# Altium project Capybara.PrjPcb (part 1 of 3)
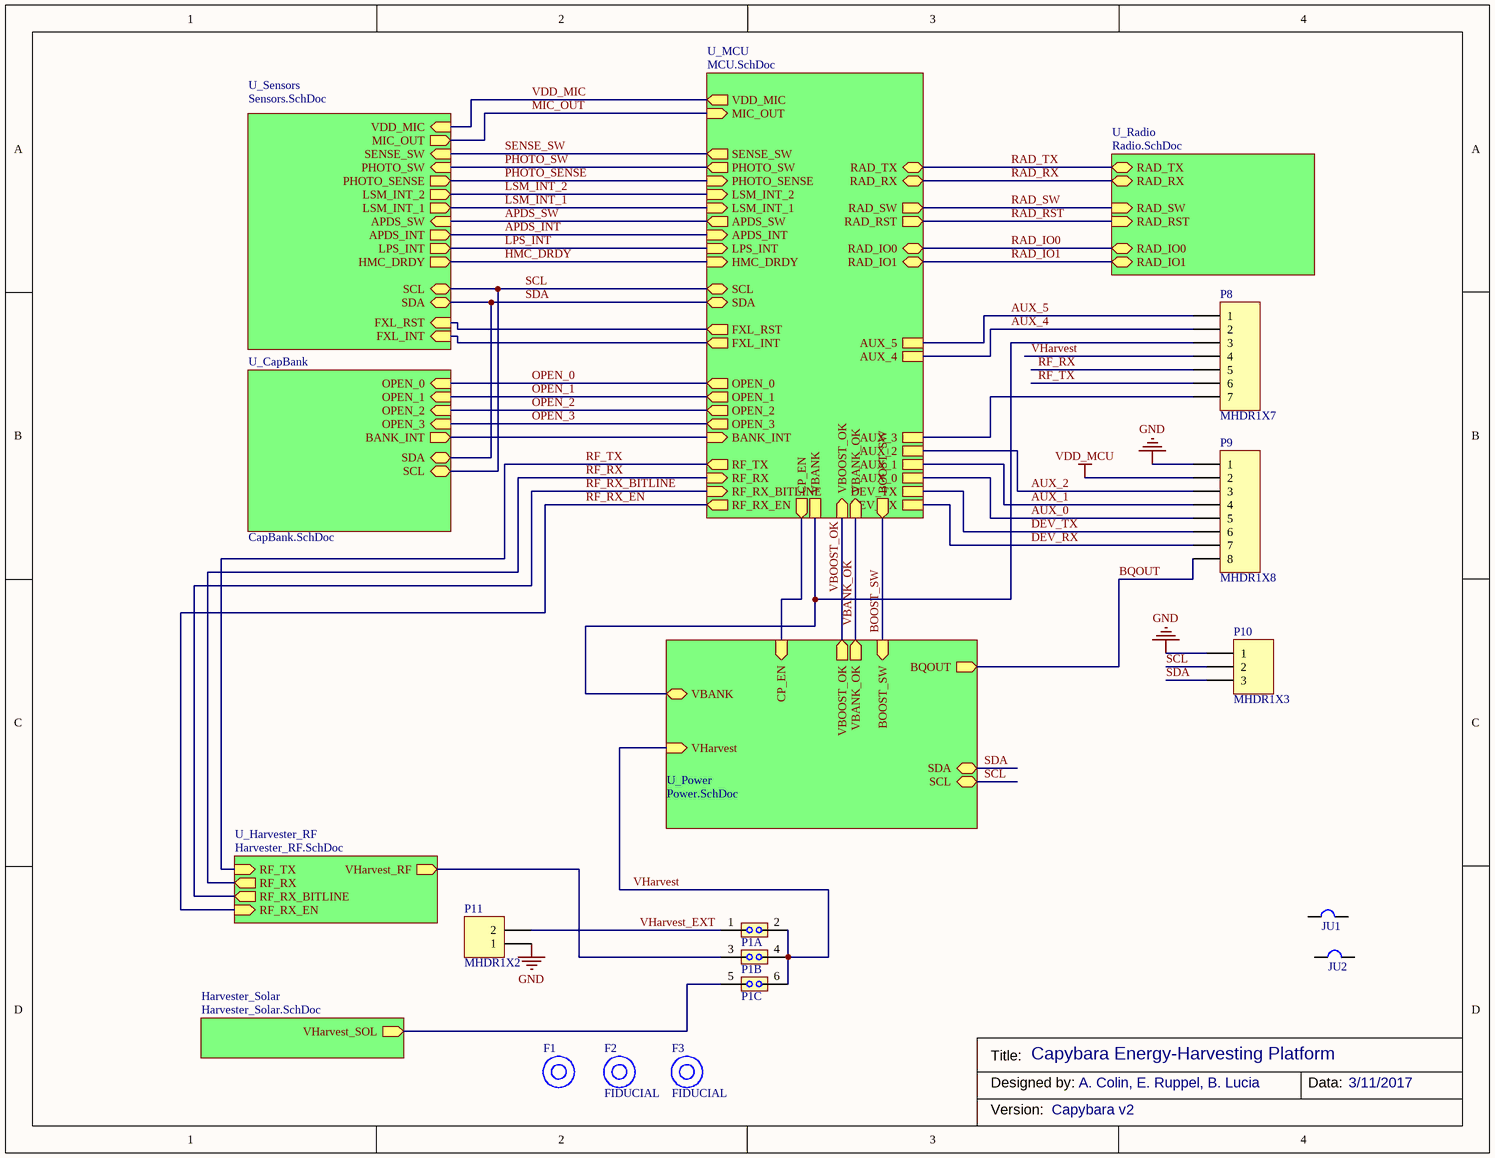
[diagram p0: Capybara.SchDoc]
12 sheets, 394 parts. Net scope: hierarchical (ports join the sheet entries above them; power ports are global).
Board file: Capybara.PcbDoc
Sheets:
  Capybara.SchDoc
    U_CapBank = CapBank.SchDoc
      U_CapBank_Introspection = CapBank_Introspection.SchDoc
      U_CapBank_Supercaps = CapBank_Supercaps.SchDoc
    U_Sensors = Sensors.SchDoc
      U_Sensors_Mic = Sensors_Mic.SchDoc
    U_Power = Power.SchDoc
      U_VtopControl = Power_VtopControl.SchDoc
    U_Radio = Radio.SchDoc
    Harvester_Solar = Harvester_Solar.SchDoc
    U_Harvester_RF = Harvester_RF.SchDoc
    U_MCU = MCU.SchDoc

## Sheet Capybara.SchDoc
size Letter; SheetNumber: 1; PageSetup: Record=PageOptions|CenterHorizontal=True|CenterVertical=True|PrintScale=0.98|XCorrection=1.00|YCorrection=1.00|PrintKind=0|BorderSize=5000000|LeftOffset=0|BottomOffset=0|Orientation=2|PaperLength=2794|PaperWidth=2159|Scale=100|PaperSource=7|PrintQuality=-3|MediaType=1|DitherType=10|PrintScaleMode=1|PaperKind=Letter|PaperIndex=1

### Parts
F1  FIDUCIAL  [FIDUCIAL]  (value not drawn)
F2  FIDUCIAL  [FIDUCIAL]
F3  FIDUCIAL  [FIDUCIAL]
JU1  JUMPER  [JUMPER0603]  (value not drawn)
JU2  JUMPER  [JUMPER0603]  (value not drawn)
P1  JMPHDR_12  [MHDR2X12]  (value not drawn)  (parts A,B,C of 12)
P8  MHDR1X7  [MHDR1X7]
P9  MHDR1X8  [MHDR1X8]
P10  MHDR1X3  [MHDR1X3]
P11  MHDR1X2  [MHDR1X2]

### Sub-sheets
Harvester_Solar = Harvester_Solar.SchDoc: VHarvest_SOL (out)
U_CapBank = CapBank.SchDoc: OPEN_1 (in), OPEN_2 (in), OPEN_3 (in), OPEN_0 (in), BANK_INT (out), SDA (bidir), SCL (bidir)
U_Harvester_RF = Harvester_RF.SchDoc: RF_TX (in), RF_RX_EN (in), RF_RX (out), RF_RX_BITLINE (out), VHarvest_RF (out)
U_MCU = MCU.SchDoc: AUX_2, AUX_1, AUX_0, AUX_3, AUX_4, AUX_5, APDS_INT (in), HMC_DRDY (in), LSM_INT_1 (in), OPEN_0 (out), OPEN_1 (out), OPEN_3 (out), OPEN_2 (out), RAD_TX (bidir), RAD_RX (bidir), DEV_TX, DEV_RX, VBANK_OK (in), VBOOST_OK (in), SCL (bidir), SDA (bidir), CP_EN (out), BOOST_SW (out), RAD_IO1 (bidir), RAD_IO0 (bidir), RAD_RST (out), RAD_SW (out), VBANK, LSM_INT_2 (in), APDS_SW (out), PHOTO_SW (out), RF_RX_EN (out), SENSE_SW (out), RF_RX (in), RF_RX_BITLINE (in), RF_TX (out), PHOTO_SENSE (in), LPS_INT (in), MIC_OUT (in), VDD_MIC (out), BANK_INT (in), FXL_RST (out), FXL_INT (out)
U_Power = Power.SchDoc: VBANK_OK (out), VBOOST_OK (out), BOOST_SW (in), VBANK, BQOUT (out), VHarvest (in), CP_EN (in), SDA (bidir), SCL (bidir)
U_Radio = Radio.SchDoc: RAD_RX (bidir), RAD_TX (bidir), RAD_SW (in), RAD_RST (in), RAD_IO0 (bidir), RAD_IO1 (bidir)
U_Sensors = Sensors.SchDoc: APDS_INT (out), SCL (bidir), SDA (bidir), SENSE_SW (in), PHOTO_SW (in), PHOTO_SENSE (out), APDS_SW (in), HMC_DRDY (out), LSM_INT_2 (out), LSM_INT_1 (out), LPS_INT (out), FXL_RST (in), FXL_INT (in), VDD_MIC (in), MIC_OUT (out)

### Nets
GND: P9.1 P10.1 P11.1
VDD_MCU: P9.2
APDS_INT: sheet U_Sensors/APDS_INT, sheet U_MCU/APDS_INT
APDS_SW: sheet U_Sensors/APDS_SW, sheet U_MCU/APDS_SW
AUX_0: P9.5 ; sheet U_MCU/AUX_0
AUX_1: P9.4 ; sheet U_MCU/AUX_1
AUX_2: P9.3 ; sheet U_MCU/AUX_2
AUX_3: P8.7 ; sheet U_MCU/AUX_3
AUX_4: P8.2 ; sheet U_MCU/AUX_4
AUX_5: P8.1 ; sheet U_MCU/AUX_5
BANK_INT: sheet U_CapBank/BANK_INT, sheet U_MCU/BANK_INT
BOOST_SW: sheet U_Power/BOOST_SW, sheet U_MCU/BOOST_SW
BQOUT: P9.8 ; sheet U_Power/BQOUT
CP_EN: sheet U_Power/CP_EN, sheet U_MCU/CP_EN
DEV_RX: P9.7 ; sheet U_MCU/DEV_RX
DEV_TX: P9.6 ; sheet U_MCU/DEV_TX
FXL_INT: sheet U_Sensors/FXL_INT, sheet U_MCU/FXL_INT
FXL_RST: sheet U_Sensors/FXL_RST, sheet U_MCU/FXL_RST
HMC_DRDY: sheet U_Sensors/HMC_DRDY, sheet U_MCU/HMC_DRDY
LPS_INT: sheet U_Sensors/LPS_INT, sheet U_MCU/LPS_INT
LSM_INT_1: sheet U_Sensors/LSM_INT_1, sheet U_MCU/LSM_INT_1
LSM_INT_2: sheet U_Sensors/LSM_INT_2, sheet U_MCU/LSM_INT_2
MIC_OUT: sheet U_Sensors/MIC_OUT, sheet U_MCU/MIC_OUT
OPEN_0: sheet U_CapBank/OPEN_0, sheet U_MCU/OPEN_0
OPEN_1: sheet U_CapBank/OPEN_1, sheet U_MCU/OPEN_1
OPEN_2: sheet U_CapBank/OPEN_2, sheet U_MCU/OPEN_2
OPEN_3: sheet U_CapBank/OPEN_3, sheet U_MCU/OPEN_3
PHOTO_SENSE: sheet U_Sensors/PHOTO_SENSE, sheet U_MCU/PHOTO_SENSE
PHOTO_SW: sheet U_Sensors/PHOTO_SW, sheet U_MCU/PHOTO_SW
RAD_IO0: sheet U_Radio/RAD_IO0, sheet U_MCU/RAD_IO0
RAD_IO1: sheet U_Radio/RAD_IO1, sheet U_MCU/RAD_IO1
RAD_RST: sheet U_Radio/RAD_RST, sheet U_MCU/RAD_RST
RAD_RX: sheet U_Radio/RAD_RX, sheet U_MCU/RAD_RX
RAD_SW: sheet U_Radio/RAD_SW, sheet U_MCU/RAD_SW
RAD_TX: sheet U_Radio/RAD_TX, sheet U_MCU/RAD_TX
RF_RX: P8.5 ; sheet U_Harvester_RF/RF_RX, sheet U_MCU/RF_RX
RF_RX_BITLINE: sheet U_Harvester_RF/RF_RX_BITLINE, sheet U_MCU/RF_RX_BITLINE
RF_RX_EN: sheet U_Harvester_RF/RF_RX_EN, sheet U_MCU/RF_RX_EN
RF_TX: P8.6 ; sheet U_Harvester_RF/RF_TX, sheet U_MCU/RF_TX
SCL: P10.2 ; sheet U_CapBank/SCL, sheet U_Sensors/SCL, sheet U_Power/SCL, sheet U_MCU/SCL
SDA: P10.3 ; sheet U_CapBank/SDA, sheet U_Sensors/SDA, sheet U_Power/SDA, sheet U_MCU/SDA
SENSE_SW: sheet U_Sensors/SENSE_SW, sheet U_MCU/SENSE_SW
VBANK: P8.3 ; sheet U_Power/VBANK, sheet U_MCU/VBANK
VBANK_OK: sheet U_Power/VBANK_OK, sheet U_MCU/VBANK_OK
VBOOST_OK: sheet U_Power/VBOOST_OK, sheet U_MCU/VBOOST_OK
VDD_MIC: sheet U_Sensors/VDD_MIC, sheet U_MCU/VDD_MIC
VHarvest: P1.2 P1.4 P1.6 P8.4 ; sheet U_Power/VHarvest
VHarvest_EXT: P1.1 P11.2
VHarvest_RF: P1.3 ; sheet U_Harvester_RF/VHarvest_RF
VHarvest_SOL: P1.5 ; sheet Harvester_Solar/VHarvest_SOL

Not connected (* = marked no-connect by the designer): JU1 1 2; JU2 1 2

### Notes on the sheet
- Title:
- Designed by:
- Capybara Energy-Harvesting Platform
- A. Colin, E. Ruppel, B. Lucia
- Data:
- 3/11/2017
- Version:
- Capybara v2

### Library data of the parts
P1 = JMPHDR_12: Manufacturer: Sullins Connector Solutions; Manufacturer Part Number: GRPB122VWVN-RC; Digi-Key Part Number: S9015E-12-ND; Distributor: Digikey; Distributor Part Number: S9015E-12-ND
P8 = MHDR1X7: Header, 7-Pin; Manufacturer Part Number: M52-5000745; Manufacturer: Harwin Inc.; LatestRevisionDate: 17-Jul-2002; LatestRevisionNote: Re-released for DXP Platform.; Publisher: Altium Limited; Digi-Key Part Number: 952-3360-ND; Distributor: Mouser; Distributor Part Number: 855-M52-5000745; Mouser Part Number: 855-M52-5000745
P9 = MHDR1X8: Header, 8-Pin; Manufacturer: Harwin Inc.; Manufacturer Part Number: M52-5000845; LatestRevisionDate: 17-Jul-2002; LatestRevisionNote: Re-released for DXP Platform.; Publisher: Altium Limited; Digi-Key Part Number: 952-3361-ND; Distributor: Mouser; Distributor Part Number: 855-M52-5000845; Mouser Part Number: 855-M52-5000845
P10 = MHDR1X3: Header, 3-Pin; Manufacturer: Harwin Inc.; Manufacturer Part Number: M52-5000345; LatestRevisionDate: 17-Jul-2002; LatestRevisionNote: Re-released for DXP Platform.; Publisher: Altium Limited; Digi-Key Part Number: 952-3357-ND; Distributor: Mouser; Distributor Part Number: 855-M52-5000345; Mouser Part Number: 855-M52-5000345
P11 = MHDR1X2: Header, 2-Pin; Manufacturer: Samtec Inc.; Manufacturer Part Number: SLM-102-01-S-S; LatestRevisionDate: 17-Jul-2002; LatestRevisionNote: Re-released for DXP Platform.; Publisher: Altium Limited; Digi-Key Part Number: SAM9931-ND; Distributor: Digikey; Distributor Part Number: SAM9931-ND

## Sheet CapBank.SchDoc
size A; SheetNumber: 2; DocumentName: Reconfigurable Capacitor Bank
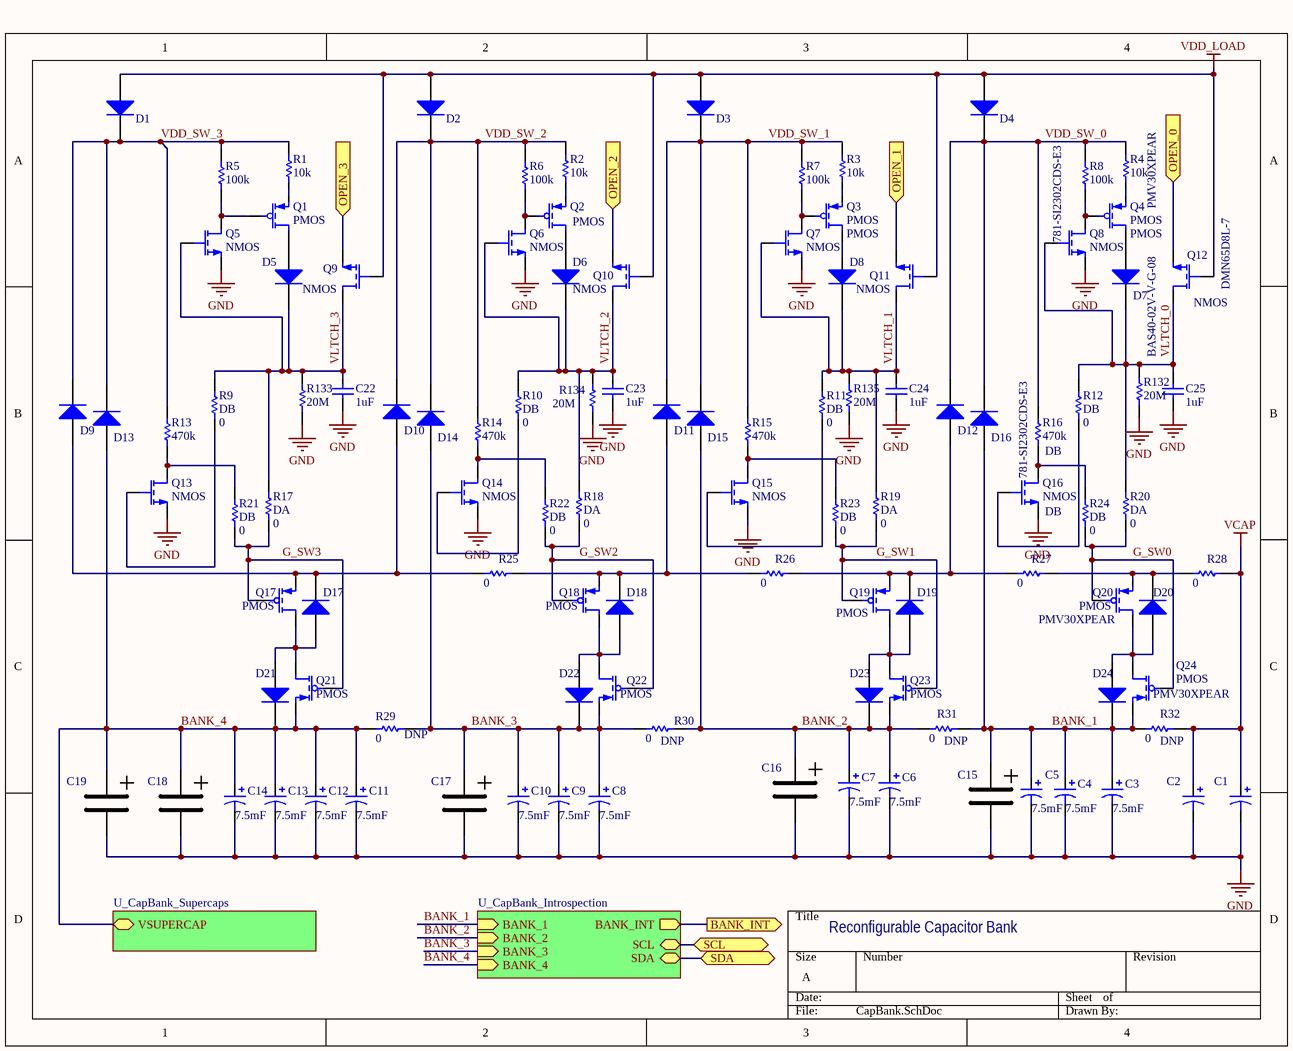
[diagram p1: CapBank.SchDoc]

### Parts
C1  Cap - Polarized  [CAP_CPH3225A]  (value not drawn)
C2  Cap - Polarized  [CAP_CPH3225A]  (value not drawn)
C3  value 7.5mF  [CAP_CPH3225A]  (hidden comment: Cap - Polarized)
C4  value 7.5mF  [CAP_CPH3225A]  (hidden comment: Cap - Polarized)
C5  value 7.5mF  [CAP_CPH3225A]  (hidden comment: Cap - Polarized)
C6  value 7.5mF  [CAP_CPH3225A]  (hidden comment: Cap - Polarized)
C7  value 7.5mF  [CAP_CPH3225A]  (hidden comment: Cap - Polarized)
C8  value 7.5mF  [CAP_CPH3225A]  (hidden comment: Cap - Polarized)
C9  value 7.5mF  [CAP_CPH3225A]  (hidden comment: Cap - Polarized)
C10  value 7.5mF  [CAP_CPH3225A]  (hidden comment: Cap - Polarized)
C11  value 7.5mF  [CAP_CPH3225A]  (hidden comment: Cap - Polarized)
C12  value 7.5mF  [CAP_CPH3225A]  (hidden comment: Cap - Polarized)
C13  value 7.5mF  [CAP_CPH3225A]  (hidden comment: Cap - Polarized)
C14  value 7.5mF  [CAP_CPH3225A]  (hidden comment: Cap - Polarized)
C15  304DCN2R7SCBB  [CAP_ILLINOIS_DCN]  (value not drawn)
C16  304DCN2R7SCBB  [CAP_ILLINOIS_DCN]  (value not drawn)
C17  304DCN2R7SCBB  [CAP_ILLINOIS_DCN]  (value not drawn)
C18  304DCN2R7SCBB  [CAP_ILLINOIS_DCN]  (value not drawn)
C19  304DCN2R7SCBB  [CAP_ILLINOIS_DCN]  (value not drawn)
C22  value 1uF  [0603]  (hidden comment: Cap)
C23  value 1uF  [0603]  (hidden comment: Cap)
C24  value 1uF  [0603]  (hidden comment: Cap)
C25  value 1uF  [0603]  (hidden comment: Cap)
D1  Diode  [SOD-523]  (value not drawn)
D2  Diode  [SOD-523]  (value not drawn)
D3  Diode  [SOD-523]  (value not drawn)
D4  Diode  [SOD-523]  (value not drawn)
D5  Diode  [SOD-523]  (value not drawn)
D6  Diode  [SOD-523]  (value not drawn)
D7  Manufacturer Part Number: BAS40-02V-V-G-08  [SOD-523]  (hidden comment: Diode)
D8  Diode  [SOD-523]  (value not drawn)
D9  Diode  [SOD-523]  (value not drawn)
D10  Diode  [SOD-523]  (value not drawn)
D11  Diode  [SOD-523]  (value not drawn)
D12  Diode  [SOD-523]  (value not drawn)
D13  Diode  [SOD-523]  (value not drawn)
D14  Diode  [SOD-523]  (value not drawn)
D15  Diode  [SOD-523]  (value not drawn)
D16  Diode  [SOD-523]  (value not drawn)
D17  Diode  [SOD-523]  (value not drawn)
D18  Diode  [SOD-523]  (value not drawn)
D19  Diode  [SOD-523]  (value not drawn)
D20  Diode  [SOD-523]  (value not drawn)
D21  Diode  [SOD-523]  (value not drawn)
D22  Diode  [SOD-523]  (value not drawn)
D23  Diode  [SOD-523]  (value not drawn)
D24  Diode  [SOD-523]  (value not drawn)
Q1  value PMOS  [SOT23 - N]
Q2  value PMOS  [SOT23 - N]
Q3  PMOS  [SOT23 - N]
Q4  PMOS  Manufacturer Part Number: PMV30XPEAR  [SOT23 - N]
Q5  NMOS  [SOT23 - N]
Q6  NMOS  [SOT23 - N]
Q7  NMOS  [SOT23 - N]
Q8  NMOS  Mouser Part Number: 781-SI2302CDS-E3  [SOT23 - N]
Q9  NMOS  [SOT23 - N]
Q10  NMOS  [SOT23 - N]
Q11  NMOS  [SOT23 - N]
Q12  NMOS  Manufacturer Part Number: DMN65D8L-7  [SOT23 - N]
Q13  NMOS  [SOT23 - N]
Q14  NMOS  [SOT23 - N]
Q15  NMOS  [SOT23 - N]
Q16  NMOS  Note: DB  Mouser Part Number: 781-SI2302CDS-E3  [SOT23 - N]
Q17  PMOS  [SOT23 - N]
Q18  PMOS  [SOT23 - N]
Q19  value PMOS  [SOT23 - N]
Q20  value PMOS  Manufacturer Part Number: PMV30XPEAR  [SOT23 - N]
Q21  PMOS  [SOT23 - N]
Q22  PMOS  [SOT23 - N]
Q23  value PMOS  [SOT23 - N]
Q24  value PMOS  Manufacturer Part Number: PMV30XPEAR  [SOT23 - N]
R1  value 10k  [0603]  (hidden comment: Res)
R2  value 10k  [0603]  (hidden comment: Res)
R3  value 10k  [0603]  (hidden comment: Res)
R4  value 10k  [0603]  (hidden comment: Res)
R5  value 100k  [0603]  (hidden comment: Res)
R6  value 100k  [0603]  (hidden comment: Res)
R7  value 100k  [0603]  (hidden comment: Res)
R8  value 100k  [0603]  (hidden comment: Res)
R9  DB  value 0  [0603]
R10  DB  value 0  [0603]
R11  DB  value 0  [0603]
R12  DB  value 0  [0603]
R13  value 470k  [0603]
R14  value 470k  [0603]
R15  value 470k  [0603]
R16  value 470k  Note: DB  [0603]
R17  DA  value 0  [0603]
R18  DA  value 0  [0603]
R19  DA  value 0  [0603]
R20  DA  value 0  [0603]
R21  DB  value 0  [0603]
R22  DB  value 0  [0603]
R23  DB  value 0  [0603]
R24  DB  value 0  [0603]
R25  value 0  [0603]  (hidden comment: Res)
R26  value 0  [0603]  (hidden comment: Res)
R27  value 0  [0603]  (hidden comment: Res)
R28  value 0  [0603]  (hidden comment: Res)
R29  value 0  Note: DNP  [0603]  (hidden comment: Res)
R30  value 0  Note: DNP  [0603]  (hidden comment: Res)
R31  value 0  Note: DNP  [0603]  (hidden comment: Res)
R32  value 0  Note: DNP  [0603]  (hidden comment: Res)
R132  value 20M  [0603]  (hidden comment: Res)
R133  value 20M  [0603]  (hidden comment: Res)
R134  value 20M  [0603]  (hidden comment: Res)
R135  value 20M  [0603]  (hidden comment: Res)

### Sub-sheets
U_CapBank_Introspection = CapBank_Introspection.SchDoc: BANK_INT (out), SCL (bidir), SDA (bidir), BANK_1 (in), BANK_2 (in), BANK_4 (in), BANK_3 (in)
U_CapBank_Supercaps = CapBank_Supercaps.SchDoc: VSUPERCAP (bidir)

### Ports
BANK_INT (out), OPEN_0 (in), OPEN_1 (in), OPEN_2 (in), OPEN_3 (in), SCL (bidir), SDA (bidir)

### Nets
GND: C1.2 C2.2 C3.2 C4.2 C5.2 C6.2 C7.2 C8.2 C9.2 C10.2 C11.2 C12.2 C13.2 C14.2 C15.2(N) C16.2(N) C17.2(N) C18.2(N) C19.2(N) C22.1 C23.1 C24.1 C25.1 Q5.2(S) Q6.2(S) Q7.2(S) Q8.2(S) Q13.2(S) Q14.2(S) Q15.2(S) Q16.2(S) R132.1 R133.1 R134.1 R135.1
VCAP: C1.1 C2.1 R28.2 R32.2
VDD_LOAD: D1.1(A) D2.1(A) D3.1(A) D4.1(A) Q9.1(G) Q10.1(G) Q11.1(G) Q12.1(G)
BANK_1: C3.1 C4.1 C5.1 C15.1(P) D16.1(A) D24.2(C) Q24.2(S) R31.2 R32.1 ; sheet U_CapBank_Introspection/BANK_1
BANK_2: C6.1 C7.1 C16.1(P) D15.1(A) D23.2(C) Q23.2(S) R30.2 R31.1 ; sheet U_CapBank_Introspection/BANK_2
BANK_3: C8.1 C9.1 C10.1 C17.1(P) D14.1(A) D22.2(C) Q22.2(S) R29.2 R30.1 ; sheet U_CapBank_Introspection/BANK_3
BANK_4: C11.1 C12.1 C13.1 C14.1 C18.1(P) C19.1(P) D13.1(A) D21.2(C) Q21.2(S) R29.1 ; sheet U_CapBank_Introspection/BANK_4, sheet U_CapBank_Supercaps/VSUPERCAP
BANK_INT: port BANK_INT, sheet U_CapBank_Introspection/BANK_INT
G_SW0: Q20.1(G) Q24.1(G) R20.1 R24.1
G_SW1: Q19.1(G) Q23.1(G) R19.1 R23.1
G_SW2: Q18.1(G) Q22.1(G) R18.1 R22.1
G_SW3: Q17.1(G) Q21.1(G) R17.1 R21.1
OPEN_0: Q12.2(S) ; port OPEN_0
OPEN_1: Q11.2(S) ; port OPEN_1
OPEN_2: Q10.2(S) ; port OPEN_2
OPEN_3: Q9.2(S) ; port OPEN_3
SCL: port SCL, sheet U_CapBank_Introspection/SCL
SDA: port SDA, sheet U_CapBank_Introspection/SDA
VDD_SW_0: D4.2(C) D12.2(C) D16.2(C) R4.2 R8.2 R16.2
VDD_SW_1: D3.2(C) D11.2(C) D15.2(C) R3.2 R7.2 R15.2
VDD_SW_2: D2.2(C) D10.2(C) D14.2(C) R2.2 R6.2 R14.2
VDD_SW_3: D1.2(C) D9.2(C) D13.2(C) R1.2 R5.2 R13.2
VLTCH_0: C25.2 D7.2(C) Q8.1(G) Q12.3(D) R12.2 R20.2 R132.2
VLTCH_1: C24.2 D8.2(C) Q7.1(G) Q11.3(D) R11.2 R19.2 R135.2
VLTCH_2: C23.2 D6.2(C) Q6.1(G) Q10.3(D) R10.2 R18.2 R134.2
VLTCH_3: C22.2 D5.2(C) Q5.1(G) Q9.3(D) R9.2 R17.2 R133.2
NetD5_1: D5.1(A) Q1.3(D)
NetD6_1: D6.1(A) Q2.3(D)
NetD7_1: D7.1(A) Q4.3(D)
NetD8_1: D8.1(A) Q3.3(D)
NetD9_1: D9.1(A) D10.1(A) D17.2(C) Q17.2(S) R25.1
NetD11_1: D11.1(A) D18.2(C) Q18.2(S) R25.2 R26.1
NetD12_1: D12.1(A) D19.2(C) Q19.2(S) R26.2 R27.1
NetD17_1: D17.1(A) D21.1(A) Q17.3(D) Q21.3(D)
NetD18_1: D18.1(A) D22.1(A) Q18.3(D) Q22.3(D)
NetD19_1: D19.1(A) D23.1(A) Q19.3(D) Q23.3(D)
NetD20_1: D20.1(A) D24.1(A) Q20.3(D) Q24.3(D)
NetD20_2: D20.2(C) Q20.2(S) R27.2 R28.1
NetQ1_1: Q1.1(G) Q5.3(D) R5.1
NetQ1_2: Q1.2(S) R1.1
NetQ2_1: Q2.1(G) Q6.3(D) R6.1
NetQ2_2: Q2.2(S) R2.1
NetQ3_1: Q3.1(G) Q7.3(D) R7.1
NetQ3_2: Q3.2(S) R3.1
NetQ4_1: Q4.1(G) Q8.3(D) R8.1
NetQ4_2: Q4.2(S) R4.1
NetQ13_1: Q13.1(G) R9.1
NetQ13_3: Q13.3(D) R13.1 R21.2
NetQ14_1: Q14.1(G) R10.1
NetQ14_3: Q14.3(D) R14.1 R22.2
NetQ15_1: Q15.1(G) R11.1
NetQ15_3: Q15.3(D) R15.1 R23.2
NetQ16_1: Q16.1(G) R12.1
NetQ16_3: Q16.3(D) R16.1 R24.2

### Notes on the sheet
- Reconfigurable Capacitor Bank

### Library data of the parts
C1-C14 = Cap - Polarized: Polarized Capacitor; Manufacturer Part Number: CPX3225A752D; Manufacturer: Seiko Instruments; Rating: 2.6V; Note: OPT; Digi-Key Part Number: 728-1083-1-ND; Distributor: Mouser; Distributor Part Number: 628-CPX3225A752D; Mouser Part Number: 628-CPX3225A752D
C15-C19 = SUPERCAP: EDLC Supercap; Manufacturer: Illinois Capacitor / CDE; Note: OPT; Rating: 2.7V; Value: 300mF; Distributor: Mouser; Distributor Part Number: 598-304DCN2R7SCBB; Manufacturer Part Number: 304DCN2R7SCBB; Digi-Key Part Number: 1572-1250-ND; Mouser Part Number: 598-304DCN2R7SCBB
C22-C25 = Cap: Ceramic Capacitor (Surface Mount); Manufacturer: Murata Electronics North America; Manufacturer Part Number: GRM188R61A105KA61D; Digi-Key Part Number: *; Note: *; Rating: *; Distributor Part Number: 490-1543-1-ND; Distributor: Digi-Key
D1-D6 D8-D24 = Diode: General Purpose Diode; Manufacturer: Vishay Semiconductor; Manufacturer Part Number: BAS40-02V-V-G-08; Digi-Key Part Number: BAS40-02V-V-G-08GICT-ND; Value: *; Rating: *; Note: *; Distributor Part Number: 78-BAS40-02V-V-G-08; Distributor: Mouser; Mouser Part Number: 78-BAS40-02V-V-G-08
D7 = Diode: General Purpose Diode; Manufacturer: Vishay Semiconductor; Digi-Key Part Number: BAS40-02V-V-G-08GICT-ND; Value: *; Rating: *; Note: *; Distributor Part Number: 78-BAS40-02V-V-G-08; Distributor: Mouser; Mouser Part Number: 78-BAS40-02V-V-G-08
Q1-Q3 Q17-Q19 Q21-Q23 = MOSFET-P: P-Channel MOSFET; Manufacturer Part Number: PMV30XPEAR; Manufacturer: Nexperia; Digi-Key Part Number: 1727-2531-1-ND; Note: *; Rating: *; Distributor: Mouser; Distributor Part Number: 771-PMV30XPEAR; Mouser Part Number: 771-PMV30XPEAR
  Q3 Q17 Q18 Q21 Q22: Value: PMOS
Q4 Q20 Q24 = MOSFET-P: P-Channel MOSFET; Manufacturer: Nexperia; Digi-Key Part Number: 1727-2531-1-ND; Note: *; Rating: *; Distributor: Mouser; Distributor Part Number: 771-PMV30XPEAR; Mouser Part Number: 771-PMV30XPEAR
  Q4: Value: PMOS
Q5-Q8 Q13-Q16 = MOSFET-N: N-Channel MOSFET; Manufacturer Part Number: SI2302CDS-T1-E3; Manufacturer: Vishay Siliconix; Digi-Key Part Number: SI2302CDS-T1-E3CT-ND; Rating: *; Value: NMOS; Distributor: Mouser; Distributor Part Number: 781-SI2302CDS-E3
  Q5-Q7 Q13-Q15: Note: *; Mouser Part Number: 781-SI2302CDS-E3
  Q8: Note: *
Q9-Q11 = MOSFET-N: N-Channel MOSFET; Manufacturer Part Number: DMN65D8L-7; Manufacturer: Diodes Incorporated; Digi-Key Part Number: DMN65D8L-7DICT-ND; Note: *; Rating: *; Value: NMOS; Distributor: Mouser; Distributor Part Number: 621-DMN65D8L-7; Mouser Part Number: 621-DMN65D8L-7
Q12 = MOSFET-N: N-Channel MOSFET; Manufacturer: Diodes Incorporated; Digi-Key Part Number: DMN65D8L-7DICT-ND; Note: *; Rating: *; Value: NMOS; Distributor: Mouser; Distributor Part Number: 621-DMN65D8L-7; Mouser Part Number: 621-DMN65D8L-7
R1-R4 = Res: Chip Resistor (Surface Mount); Manufacturer: Yageo; Manufacturer Part Number: RT0603DRD0747KL; Digi-Key Part Number: *; Rating: *; Note: *; Distributor: Digi-Key; Distributor Part Number: 311-47KDCT-ND
R5-R8 = Res: Chip Resistor (Surface Mount); Manufacturer: Yageo; Manufacturer Part Number: RC0603FR-071ML; Digi-Key Part Number: *; Rating: *; Note: *; Distributor: Digi-Key; Distributor Part Number: 311-1.00MHRCT-ND
R9-R12 R17-R32 = Res: Chip Resistor (Surface Mount); Manufacturer: Yageo; Manufacturer Part Number: RC0603JR-070RL; Rating: *; Distributor: Digi-Key; Distributor Part Number: 311-0.0GRCT-ND
  R9-R12 R17-R24: Note: *
R13-R16 = Res: Chip Resistor (Surface Mount); Manufacturer: Yageo; Manufacturer Part Number: RC0603FR-07470KL; Digi-Key Part Number: *; Rating: *; Distributor: Digi-Key; Distributor Part Number: 311-470KHRCT-ND
  R13-R15: Note: *
R132-R135 = Res: Chip Resistor (Surface Mount); Manufacturer: Generic Chip Res (TBD); Manufacturer Part Number: *; Digi-Key Part Number: *; Rating: *; Note: *

## Sheet CapBank_Introspection.SchDoc
size A; SheetNumber: 3
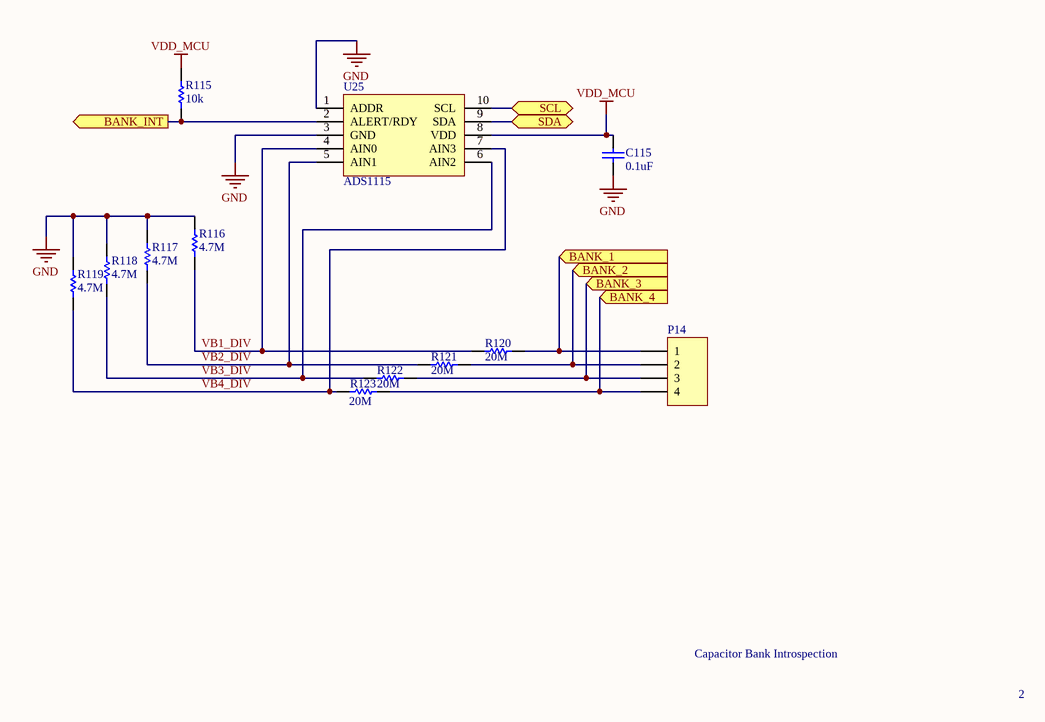
[diagram p2: CapBank_Introspection.SchDoc]

### Parts
C115  value 0.1uF  [0603]  (hidden comment: Cap)
P14  (no value)  [MHDR1X4]
R115  value 10k  [0603]  (hidden comment: Res)
R116  value 4.7M  [0603]  (hidden comment: Res)
R117  value 4.7M  [0603]  (hidden comment: Res)
R118  value 4.7M  [0603]  (hidden comment: Res)
R119  value 4.7M  [0603]  (hidden comment: Res)
R120  value 20M  [0603]  (hidden comment: Res)
R121  value 20M  [0603]  (hidden comment: Res)
R122  value 20M  [0603]  (hidden comment: Res)
R123  value 20M  [0603]  (hidden comment: Res)
U25  ADS1115  [VSSOP10]

### Ports
BANK_1 (in), BANK_2 (in), BANK_3 (in), BANK_4 (in), BANK_INT (out), SCL (bidir), SDA (bidir)

### Nets
GND: C115.1 R116.2 R117.2 R118.2 R119.2 U25.1(ADDR) U25.3(GND)
VDD_MCU: C115.2 R115.2 U25.8(VDD)
BANK_1: P14.1 R120.2 ; port BANK_1
BANK_2: P14.2 R121.2 ; port BANK_2
BANK_3: P14.3 R122.2 ; port BANK_3
BANK_4: P14.4 R123.2 ; port BANK_4
BANK_INT: R115.1 U25.2(ALERT/RDY) ; port BANK_INT
SCL: U25.10(SCL) ; port SCL
SDA: U25.9(SDA) ; port SDA
VB1_DIV: R116.1 R120.1 U25.4(AIN0)
VB2_DIV: R117.1 R121.1 U25.5(AIN1)
VB3_DIV: R118.1 R122.1 U25.6(AIN2)
VB4_DIV: R119.1 R123.1 U25.7(AIN3)

### Notes on the sheet
- Capacitor Bank Introspection
- 2

### Library data of the parts
C115 = Cap: Ceramic Capacitor (Surface Mount); Manufacturer: Murata Electronics North America; Manufacturer Part Number: GRM188R71C104KA01D; Digi-Key Part Number: *; Note: *; Rating: *; Distributor Part Number: 490-1532-1-ND; Distributor: Digi-Key
P14 = MHDR1X4: Header, 4-Pin; Manufacturer: Harwin Inc.; Manufacturer Part Number: M52-5000445; LatestRevisionDate: 17-Jul-2002; LatestRevisionNote: Re-released for DXP Platform.; Publisher: Altium Limited; Digi-Key Part Number: 952-3358-ND; Distributor: Mouser; Distributor Part Number: 855-M52-5000445; Mouser Part Number: 855-M52-5000445
R115 = Res: Chip Resistor (Surface Mount); Manufacturer: Yageo; Manufacturer Part Number: RC0603FR-0710KL; Digi-Key Part Number: *; Rating: *; Note: *; Distributor: Digi-Key; Distributor Part Number: 311-10.0KHRCT-ND
R116-R119 = Res: Chip Resistor (Surface Mount); Manufacturer: Generic Chip Res (TBD); Manufacturer Part Number: RC0603FR-074M7L; Digi-Key Part Number: *; Rating: *; Note: *; Distributor: Digi-Key; Distributor Part Number: 311-4.70MHRCT-ND
R120-R123 = Res: Chip Resistor (Surface Mount); Manufacturer: Vishay Dale; Manufacturer Part Number: CRCW060320M0JPEAHR; Digi-Key Part Number: *; Rating: *; Note: *; Distributor: Digi-Key; Distributor Part Number: 541-20MAHCT-ND
U25 = ADS1115: Manufacturer: Texas Instruments; Manufacturer Part Number: ADS1115IDGSR; Distributor: Digikey; Distributor Part Number: 296-38849-1-ND; Mouser Part Number: 595-ADS1115IDGSR; Digi-Key Part Number: 296-38849-1-ND

## Sheet CapBank_Supercaps.SchDoc
size A; SheetNumber: 4
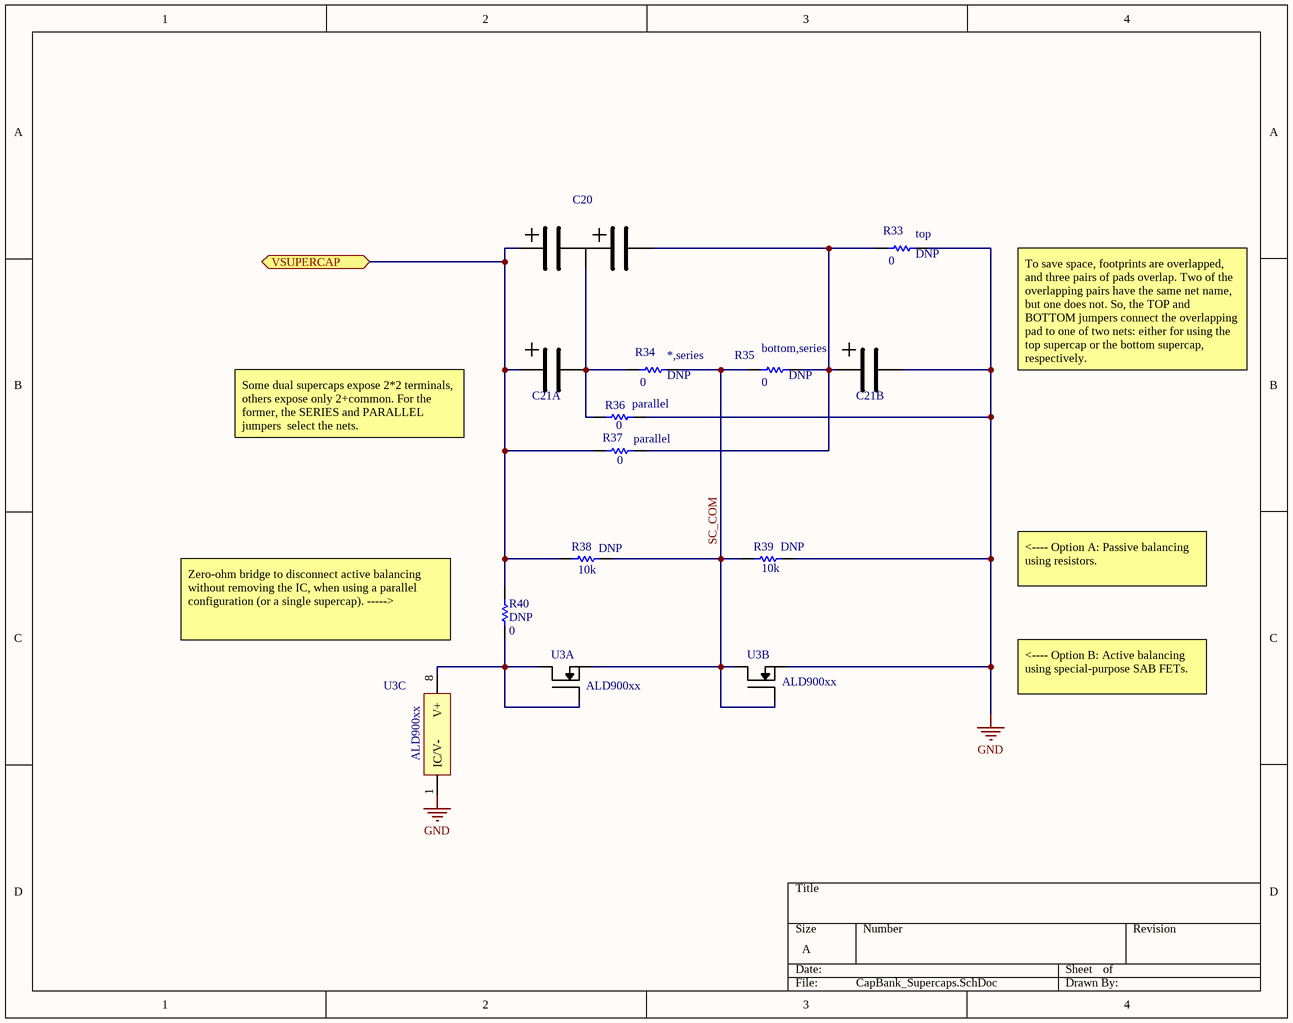
[diagram p3: CapBank_Supercaps.SchDoc]

### Parts
C20  SUPERCAP_DUAL_SERIES  [SUPERCAP_DMT]  (value not drawn)
C21  SUPERCAP_DUAL  [SUPERCAP_DMHA14R]  (value not drawn)  (parts A,B of 2)
R33  value 0  Note: DNP  Config: top  [0603]  (hidden comment: Res)
R34  value 0  Note: DNP  Config: *,series  [0603]  (hidden comment: Res)
R35  value 0  Note: DNP  Config: bottom,series  [0603]  (hidden comment: Res)
R36  value 0  Config: parallel  [0603]  (hidden comment: Res)
R37  value 0  Config: parallel  [0603]  (hidden comment: Res)
R38  value 10k  Note: DNP  [0603]  (hidden comment: Res)
R39  value 10k  Note: DNP  [0603]  (hidden comment: Res)
R40  value 0  Note: DNP  [0603]  (hidden comment: Res)
U3  ALD900xx  [SOIC8]  (parts A,B,C of 3)

### Ports
VSUPERCAP (bidir)

### Nets
GND: C21.4(N1) R33.2 R36.2 R39.2 U3.1(IC/V-) U3.5(SN2)
BANK_4: C20.1(P) C21.1(P2) R37.1 R38.1 R40.1 ; port VSUPERCAP
SC_COM: R34.2 R35.1 R38.2 R39.1 U3.4(SN1) U3.6(DN2) U3.7(GN2)
NetC20_2: C20.2(BAL) C21.2(N2) R34.1 R36.1
NetC20_3: C20.3(N) C21.3(P1) R33.1 R35.2 R37.2
NetR40_2: R40.2 U3.2(GN1) U3.3(DN1) U3.8(V+)

### Notes on the sheet
- To save space, footprints are overlapped, and three pairs of pads overlap. Two of the overlapping pairs have the same net name, but one does not. So, the TOP and BOTTOM jumpers connect the overlapping pad to one of two nets: either for using the top supercap or the bottom supercap, respectively.
- Some dual supercaps expose 2*2 terminals, others expose only 2+common. For the former, the SERIES and PARALLEL jumpers  select the nets.
- Zero-ohm bridge to disconnect active balancing without removing the IC, when using a parallel configuration (or a single supercap). ----->
- <---- Option A: Passive balancing using resistors.
- <---- Option B: Active balancing using special-purpose SAB FETs.

### Library data of the parts
C20 = SUPERCAP_DUAL_SERIES: EDLC Supercap Dual with Balancing Terminal; Manufacturer: Murata Electronics; Manufacturer Part Number: DMT3N4R2U224M3DTA0; Note: OPT; Rating: 4.2/2.1V; Value: 220mF; Digi-Key Part Number: 490-13208-ND; Distributor: Mouser; Distributor Part Number: 81-DMT3N4R2U224M3DT0; Mouser Part Number: 81-DMT3N4R2U224M3DT0
C21 = SUPERCAP_DUAL: EDLC Supercap Dual; Manufacturer: Murata Electronics; Manufacturer Part Number: DMHA14R5V353M4ATA0; Note: OPT; Rating: 4.5/2.25V; Value: 35mF; Digi-Key Part Number: 490-17331-ND; Distributor: Mouser; Distributor Part Number: 81-DMHA14R5V353M4ATA; Mouser Part Number: 81-DMHA14R5V353M4ATA
R33-R37 R40 = Res: as R9 on sheet CapBank; Rating: *; Distributor: Digi-Key; Distributor Part Number: 311-0.0GRCT-ND
  R40: Digi-Key Part Number: *
R38 R39 = Res: as R115 on sheet CapBank_Introspection; Digi-Key Part Number: *; Rating: *; Distributor: Digi-Key; Distributor Part Number: 311-10.0KHRCT-ND
U3 = ALD9100xx: Manufacturer: Advanced Linear Devices Inc.; Manufacturer Part Number: ALD910021SAL; Distributor: Digikey; Distributor Part Number: 1014-1281-5-ND; Mouser Part Number: 585-ALD910021SAL; Digi-Key Part Number: 1014-1281-5-ND

## Sheet Sensors.SchDoc
size Letter; SheetNumber: 11
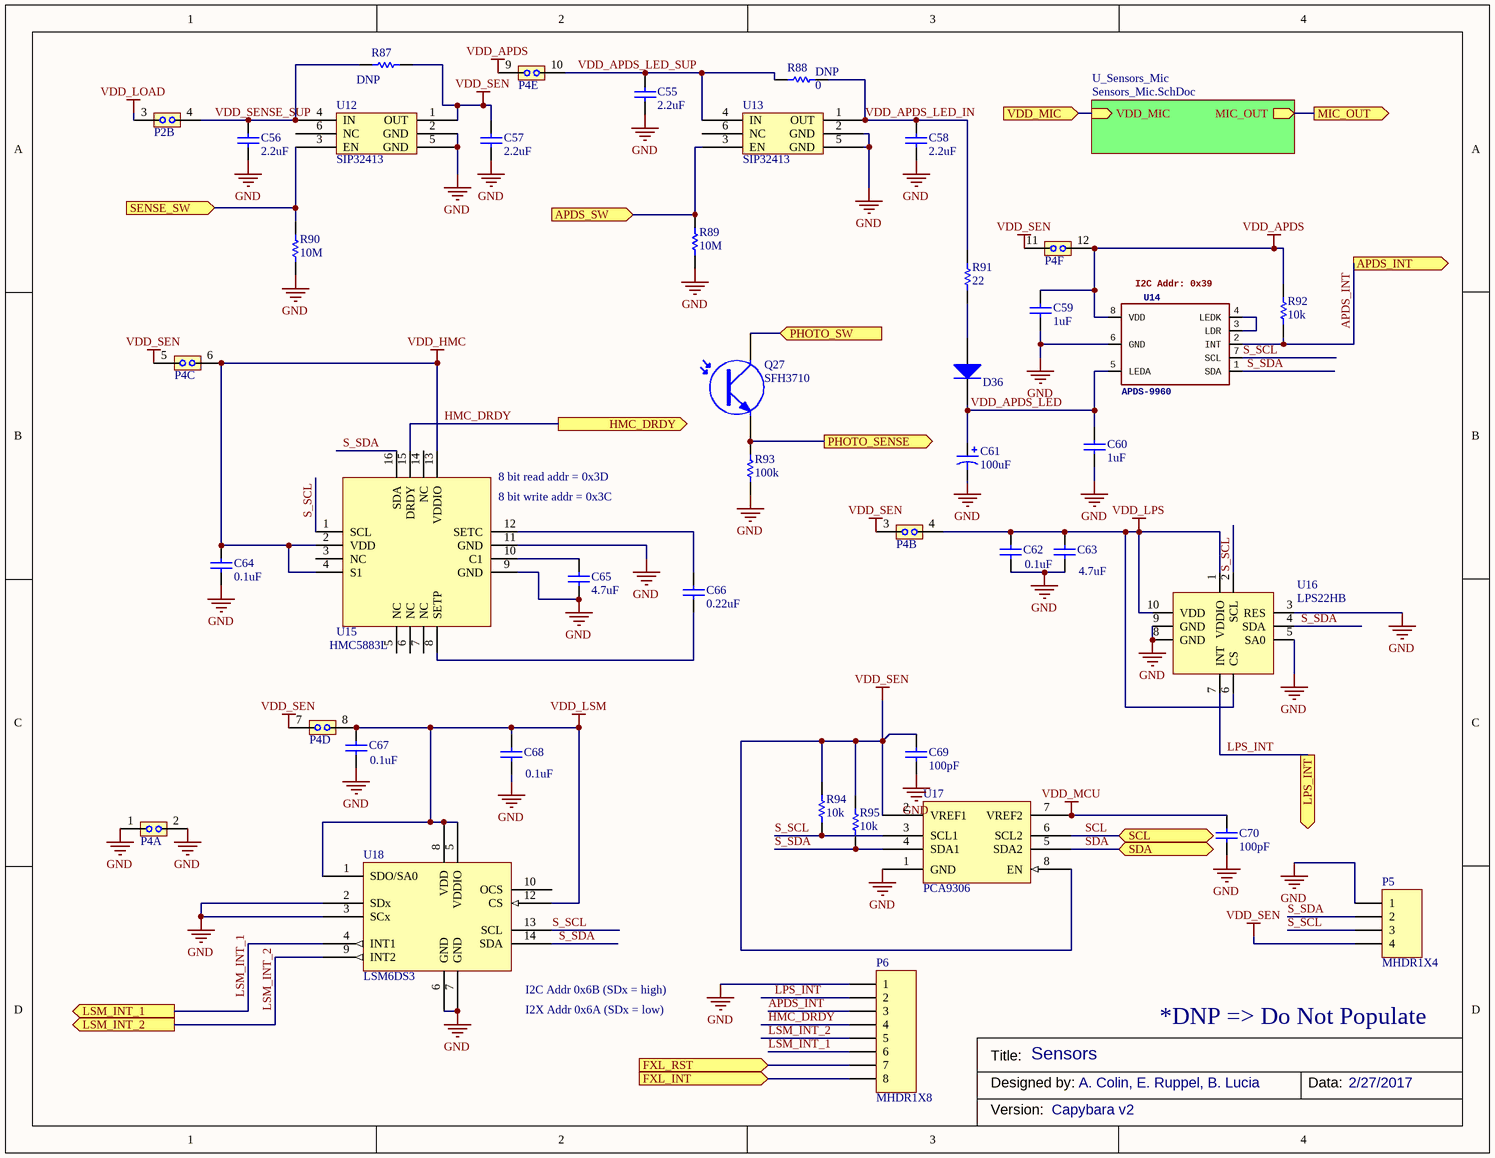
[diagram p4: Sensors.SchDoc]

### Parts
C55  value 2.2uF  [0603]  (hidden comment: Cap)
C56  value 2.2uF  [0603]  (hidden comment: Cap)
C57  value 2.2uF  [0603]  (hidden comment: Cap)
C58  value 2.2uF  [0603]  (hidden comment: Cap)
C59  value 1uF  [0603]  (hidden comment: Cap)
C60  value 1uF  [0603]  (hidden comment: Cap)
C61  value 100uF  [0805]  (hidden comment: Cap - Polarized)
C62  value 0.1uF  [0603]  (hidden comment: Cap)
C63  value 4.7uF  [0603]  (hidden comment: Cap)
C64  value 0.1uF  [0603]  (hidden comment: Cap)
C65  value 4.7uF  [0603]  (hidden comment: Cap)
C66  value 0.22uF  [0603]  (hidden comment: Cap)
C67  value 0.1uF  [0603]  (hidden comment: Cap)
C68  value 0.1uF  [0603]  (hidden comment: Cap)
C69  value 100pF  [0603]  (hidden comment: Cap)
C70  value 100pF  [0603]  (hidden comment: Cap)
D36  Diode  [SOD-523]  (value not drawn)
P2  JMPHDR_8  [MHDR2X8]  (value not drawn)  (part B of 8)
P4  JMPHDR_6  [MHDR2X6]  (value not drawn)  (parts A,B,C,D,E,F of 6)
P5  MHDR1X4  [MHDR1X4]
P6  MHDR1X8  [MHDR1X8]
Q27  SFH3710  [0805-W]
R87  Note: DNP  [0603]  (hidden comment: Res)
R88  value 0  Note: DNP  [0603]  (hidden comment: Res)
R89  value 10M  [0603]  (hidden comment: Res)
R90  value 10M  [0603]  (hidden comment: Res)
R91  value 22  [0603]  (hidden comment: Res)
R92  value 10k  [0603]  (hidden comment: Res)
R93  value 100k  [0603]  (hidden comment: Res)
R94  value 10k  [0603]  (hidden comment: Res)
R95  value 10k  [0603]  (hidden comment: Res)
U12  SIP32413  [SC70-6]
U13  SIP32413  [SC70-6]
U14  APDS-9960  [DFN_APDS_v2]
U15  HMC5883L  [SPARKFUN_16LPCC-DUP]
U16  LPS22HB  [HLGA-10L]
U17  PCA9306  [8-VFSOP]
U18  LSM6DS3  [LGA-14]

### Sub-sheets
U_Sensors_Mic = Sensors_Mic.SchDoc: MIC_OUT (out), VDD_MIC (in)

### Ports
APDS_INT (out), APDS_SW (in), FXL_INT (in), FXL_RST (in), HMC_DRDY (out), LPS_INT (out), LSM_INT_1 (out), LSM_INT_2 (out), MIC_OUT (out), PHOTO_SENSE (out), PHOTO_SW (in), SCL (bidir), SDA (bidir), SENSE_SW (in), VDD_MIC (in)

### Nets
GND: C55.1 C56.1 C57.1 C58.1 C59.1 C60.1 C61.2 C62.2 C63.2 C64.2 C65.2 C67.2 C68.2 C69.1 C70.1 P4.1 P4.2 P5.1 P6.1 R89.1 R90.1 R93.1 U12.2(GND) U12.5(GND) U13.2(GND) U13.5(GND) U14.6(GND) U15.9(GND) U15.11(GND) U16.3(RES) U16.5(SA0) U16.8(GND) U16.9(GND) U17.1(GND) U18.2(SDx) U18.3(SCx) U18.6(GND) U18.7(GND)
VDD_APDS: C59.2 P4.9 P4.12 R92.2 U14.8(VDD)
VDD_HMC: C64.1 P4.6 U15.2(VDD) U15.4(S1) U15.13(VDDIO)
VDD_LOAD: P2.3
VDD_LPS: C62.1 C63.1 P4.4 U16.1(VDDIO) U16.6(CS) U16.10(VDD)
VDD_LSM: C67.1 C68.1 P4.8 U18.1(SDO/SA0) U18.5(VDDIO) U18.8(VDD) U18.12(CS)
VDD_MCU: C70.2 U17.7(VREF2)
VDD_SEN: C57.2 C69.2 P4.3 P4.5 P4.7 P4.11 P5.4 R87.2 R94.2 R95.2 U12.1(OUT) U17.2(VREF1) U17.8(EN)
APDS_INT: P6.3 R92.1 U14.2(INT) ; port APDS_INT
APDS_SW: R89.2 U13.3(EN) ; port APDS_SW
FXL_INT: P6.8 ; port FXL_INT
FXL_RST: P6.7 ; port FXL_RST
HMC_DRDY: P6.4 U15.15(DRDY) ; port HMC_DRDY
LPS_INT: P6.2 U16.7(INT) ; port LPS_INT
LSM_INT_1: P6.6 U18.4(INT1) ; port LSM_INT_1
LSM_INT_2: P6.5 U18.9(INT2) ; port LSM_INT_2
MIC_OUT: port MIC_OUT, sheet U_Sensors_Mic/MIC_OUT
PHOTO_SENSE: Q27.2(E) R93.2 ; port PHOTO_SENSE
PHOTO_SW: Q27.1(C) ; port PHOTO_SW
S_SCL: P5.3 R94.1 U14.7(SCL) U15.1(SCL) U16.2(SCL) U17.3(SCL1) U18.13(SCL)
S_SDA: P5.2 R95.1 U14.1(SDA) U15.16(SDA) U16.4(SDA) U17.4(SDA1) U18.14(SDA)
SCL: U17.6(SCL2) ; port SCL
SDA: U17.5(SDA2) ; port SDA
SENSE_SW: R90.2 U12.3(EN) ; port SENSE_SW
VDD_APDS_LED: C60.2 C61.1 D36.2(C) U14.5(LEDA)
VDD_APDS_LED_IN: C58.2 R88.2 R91.2 U13.1(OUT)
VDD_APDS_LED_SUP: C55.2 P4.10 R88.1 U13.4(IN)
VDD_MIC: port VDD_MIC, sheet U_Sensors_Mic/VDD_MIC
VDD_SENSE_SUP: C56.2 P2.4 R87.1 U12.4(IN)
NetC65_1: C65.1 U15.10(C1)
NetC66_1: C66.1 U15.8(SETP)
NetC66_2: C66.2 U15.12(SETC)
NetD36_1: D36.1(A) R91.1
NetU14_3: U14.3(LDR) U14.4(LEDK)

Not connected (* = marked no-connect by the designer): U12 6(NC); U13 6(NC); U15 3(NC) 5(NC) 6(NC) 7(NC) 14(NC); U18 10(OCS)

### Notes on the sheet
- (near U14) I2C Addr: 0x39
- (near U15) 8 bit read addr = 0x3D
- (near U15) 8 bit write addr = 0x3C
- (near U18) I2C Addr 0x6B (SDx = high)
- (near U18) I2X Addr 0x6A (SDx = low)
- *DNP => Do Not Populate
- Title:
- Designed by:
- Sensors
- A. Colin, E. Ruppel, B. Lucia
- Data:
- 2/27/2017
- Version:
- Capybara v2

### Library data of the parts
C55-C58 = Cap: Ceramic Capacitor (Surface Mount); Manufacturer: Murata Electronics North America; Manufacturer Part Number: GRM188R61C225KE15D; Digi-Key Part Number: *; Note: *; Rating: *; Distributor Part Number: 490-3296-1-ND; Distributor: Digi-Key
C59 C60 = Cap: as C22 on sheet CapBank; Note: *; Rating: *; Distributor Part Number: 490-1543-1-ND; Distributor: Digi-Key
C61 = Cap - Polarized: Polarized Capacitor; Manufacturer Part Number: GRM21BR60G107ME15L; Manufacturer: Murata Electronics North America; Digi-Key Part Number: *; Rating: *; Note: *; Distributor: Mouser; Mouser Part Number: 81-GRM21BR60G107ME5L
C62 C64 C67 C68 = Cap: as C115 on sheet CapBank_Introspection; Note: *; Rating: *; Distributor Part Number: 490-1532-1-ND; Distributor: Digi-Key
C63 = Cap: Ceramic Capacitor (Surface Mount); Manufacturer: Samsung Electro-Mechanics; Manufacturer Part Number: CL10B475KQ8NQNC; Note: *; Rating: *; Distributor Part Number: 1276-2087-1-ND; Distributor: Digi-Key
C65 = Cap: CAP CER 4.7UF 4V X6S; Manufacturer: Samsung Electro-Mechanics; Manufacturer Part Number: CL10B475KQ8NQNC; Note: *; Rating: *; Distributor Part Number: 1276-2087-1-ND; Distributor: Digi-Key
C66 = Cap: Ceramic Capacitor (Surface Mount); Manufacturer: Murata Electronics North America; Manufacturer Part Number: GRM188R71E224KA88D; Note: *; Rating: *; Distributor Part Number: 490-3290-1-ND; Distributor: Digi-Key
C69 C70 = Cap: Ceramic Capacitor (Surface Mount); Manufacturer: Kemet; Manufacturer Part Number: C0603C101J5GACTU; Digi-Key Part Number: *; Note: *; Rating: *; Distributor Part Number: 399-1061-1-ND; Distributor: Digi-Key
D36 = Diode: as D1 on sheet CapBank; Digi-Key Part Number: BAS40-02V-V-G-08GICT-ND; Value: *; Rating: *; Note: *; Distributor Part Number: 78-BAS40-02V-V-G-08; Distributor: Mouser; Mouser Part Number: 78-BAS40-02V-V-G-08
P4 = JMPHDR_6: Manufacturer: Sullins Connector Solutions; Manufacturer Part Number: GRPB062VWVN-RC; Digi-Key Part Number: S9015E-06-ND; Distributor: Digikey; Distributor Part Number: S9015E-06-ND
P5 = MHDR1X4: as P14 on sheet CapBank_Introspection; LatestRevisionDate: 17-Jul-2002; LatestRevisionNote: Re-released for DXP Platform.; Publisher: Altium Limited; Digi-Key Part Number: 952-3358-ND; Distributor: Mouser; Distributor Part Number: 855-M52-5000445; Mouser Part Number: 855-M52-5000445
P6 = MHDR1X8: as P9 on sheet Capybara; LatestRevisionDate: 17-Jul-2002; LatestRevisionNote: Re-released for DXP Platform.; Publisher: Altium Limited; Digi-Key Part Number: 952-3361-ND; Distributor: Mouser; Distributor Part Number: 855-M52-5000845; Mouser Part Number: 855-M52-5000845
Q27 = Photo NPN: NPN Phototransistor; Manufacturer: OSRAM Opto Semiconductors Inc; Manufacturer Part Number: SFH 3710-3/4-Z; Digi-Key Part Number: 475-1268-1-ND; Value: *; Rating: *; Note: *; Distributor: Mouser; Distributor Part Number: 720-SFH3710-3/4-Z; Mouser Part Number: 720-SFH3710-3/4-Z
R87 = Res: Chip Resistor (Surface Mount); Manufacturer: Yageo; Manufacturer Part Number: RC0603JR-070RL; Value: 0; Digi-Key Part Number: *; Rating: *; Distributor: Digi-Key; Distributor Part Number: 311-0.0GRCT-ND
R88 = Res: as R9 on sheet CapBank; Digi-Key Part Number: *; Rating: *; Distributor: Digi-Key; Distributor Part Number: 311-0.0GRCT-ND
R89 R90 = Res: Chip Resistor (Surface Mount); Manufacturer: Yageo; Manufacturer Part Number: RC0603JR-0710ML; Digi-Key Part Number: *; Rating: *; Note: *; Distributor: Digi-Key; Distributor Part Number: 311-10MGRCT-ND
R91 = Res: Chip Resistor (Surface Mount); Manufacturer: Vishay Beyschlag; Manufacturer Part Number: MCT06030C2209FP500; Digi-Key Part Number: *; Rating: *; Note: *; Distributor: Digi-Key; Distributor Part Number: MCT0603-22.0-CFCT-ND
R92 R94 R95 = Res: as R115 on sheet CapBank_Introspection; Digi-Key Part Number: *; Rating: *; Note: *; Distributor: Digi-Key; Distributor Part Number: 311-10.0KHRCT-ND
R93 = Res: Chip Resistor (Surface Mount); Manufacturer: Yageo; Manufacturer Part Number: RT0603FRE07100KL; Digi-Key Part Number: *; Rating: *; Note: *; Distributor: Digi-Key; Distributor Part Number: YAG2319CT-ND
U12 U13 = SIP32431: Manufacturer: Vishay Semiconductors; Manufacturer Part Number: SIP32431DR3-T1GE3; Digi-Key Part Number: SIP32431DR3-T1GE3CT-ND; Distributor: Mouser; Distributor Part Number: 781-SIP32431DR3-GE3; Mouser Part Number: 781-SIP32431DR3-GE3
U14 = APDS-9960: Avago APDS-9960 digital proximity, ambient light, RGB, and gesture sensor.; Manufacturer: Broadcom Limited; PROD_ID: SEN-12005; Digi-Key Part Number: 516-3480-1-ND; Distributor: Mouser; Distributor Part Number: 630-APDS-9960; Manufacturer Part Number: APDS-9960; Mouser Part Number: 630-APDS-9960
U15 = HMC5883L: IC COMPASS 3 AXIS I2C 16LCC SMD; Manufacturer: Honeywell; Manufacturer Part Number: HMC5883L-TR; Rating: *; Value: *; Note: *; Distributor: eBay; Digi-Key Part Number: 342-1082-1-ND
U16 = LPS22HB: Manufacturer: STMicroelectronics; Manufacturer Part Number: LPS22HBTR; Digi-Key Part Number: 497-16265-1-ND; Distributor: Mouser; Distributor Part Number: 511-LPS22HBTR; Mouser Part Number: 511-LPS22HBTR
U17 = PCA9306: I2C Level Shifter; Manufacturer Part Number: PCA9306DCURG4; Manufacturer: Texas Instruments; Digi-Key Part Number: 296-46174-1-ND; Distributor: Mouser; Distributor Part Number: 595-PCA9306DCURG4; Mouser Part Number: 595-PCA9306DCURG4
U18 = LSM6DS3: Manufacturer: ST Microelectronics; Manufacturer Part Number: LSM6DS3TR; PurchaseNote: or Farnell 2474253; Name: LSM6DS3; Distributor: Mouser; Distributor Part Number: 511-LSM6DS3TR; Digi-Key Part Number: 497-15383-1-ND; Mouser Part Number: 511-LSM6DS3TR

## Sheet Sensors_Mic.SchDoc
size A; SheetNumber: 12
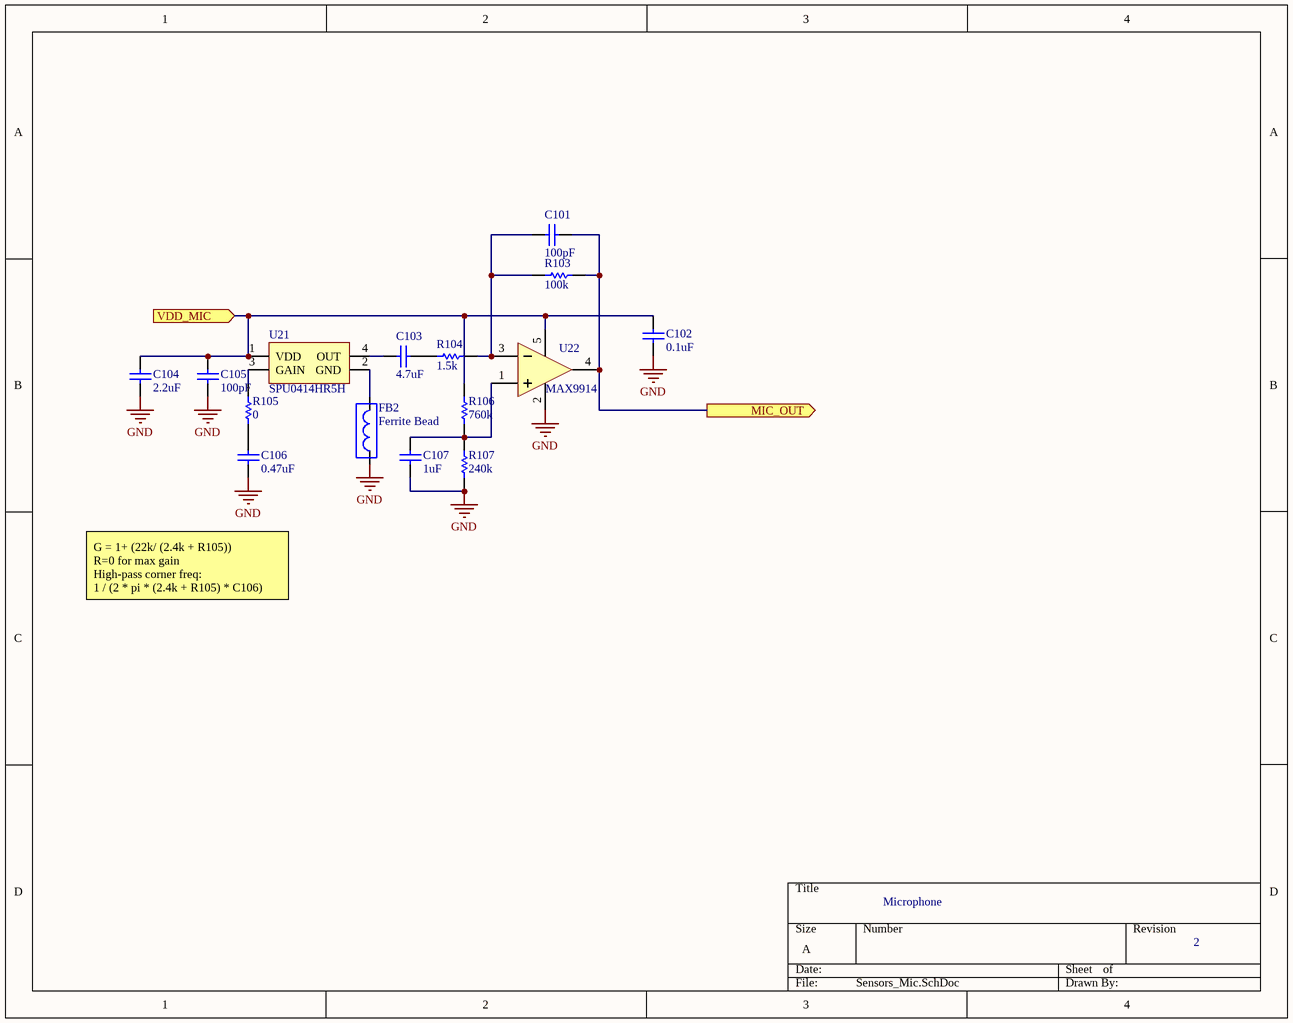
[diagram p5: Sensors_Mic.SchDoc]

### Parts
C101  value 100pF  [0603]  (hidden comment: Cap)
C102  value 0.1uF  [0603]  (hidden comment: Cap)
C103  value 4.7uF  [0603]  (hidden comment: Cap)
C104  value 2.2uF  [0603]  (hidden comment: Cap)
C105  value 100pF  [0603]  (hidden comment: Cap)
C106  value 0.47uF  [0603]  (hidden comment: Cap)
C107  value 1uF  [0603]  (hidden comment: Cap)
FB2  Ferrite Bead  [0603]
R103  value 100k  [0603]  (hidden comment: Res)
R104  value 1.5k  [0603]  (hidden comment: Res)
R105  value 0  [0603]  (hidden comment: Res)
R106  value 760k  [0603]  (hidden comment: Res)
R107  value 240k  [0603]  (hidden comment: Res)
U21  SPU0414HR5H  [SPU0414HR5H]
U22  MAX9914  [SC70-5]

### Ports
MIC_OUT (out), VDD_MIC (in)

### Nets
GND: C102.1 C104.1 C105.1 C106.1 C107.1 FB2.1 R107.1 U22.2(IN-)
MIC_OUT: C101.2 R103.2 U22.4(TAB) ; port MIC_OUT
VDD_MIC: C102.2 C104.2 C105.2 R106.2 U21.1(VDD) U22.5(OS_NUL) ; port VDD_MIC
NetC101_1: C101.1 R103.1 R104.2 U22.3(IN+)
NetC103_1: C103.1 U21.4(OUT)
NetC103_2: C103.2 R104.1
NetC106_2: C106.2 R105.1
NetC107_2: C107.2 R106.1 R107.2 U22.1(OS_NUL)
NetFB2_2: FB2.2 U21.2(GND)
NetR105_2: R105.2 U21.3(GAIN)

### Notes on the sheet
- G = 1+ (22k/ (2.4k + R105))
  R=0 for max gain
  High-pass corner freq:
  1 / (2 * pi * (2.4k + R105) * C106)
- Microphone
- 2

### Library data of the parts
C101 C105 = Cap: as C69 on sheet Sensors; Digi-Key Part Number: *; Note: *; Rating: *; Distributor Part Number: 399-1061-1-ND; Distributor: Digi-Key
C102 = Cap: as C115 on sheet CapBank_Introspection; Digi-Key Part Number: *; Note: *; Rating: *; Distributor Part Number: 490-1532-1-ND; Distributor: Digi-Key
C103 = Cap: as C63 on sheet Sensors; Digi-Key Part Number: *; Note: *; Rating: *; Distributor Part Number: 1276-2087-1-ND; Distributor: Digi-Key
C104 = Cap: as C55 on sheet Sensors; Digi-Key Part Number: *; Note: *; Rating: *; Distributor Part Number: 490-3296-1-ND; Distributor: Digi-Key
C106 = Cap: Ceramic Capacitor (Surface Mount); Manufacturer: TDK Corporation; Manufacturer Part Number: C1608X7R1C474K080AC; Digi-Key Part Number: *; Note: *; Rating: *; Distributor Part Number: 445-5192-1-ND; Distributor: Digi-Key
C107 = Cap: as C22 on sheet CapBank; Digi-Key Part Number: *; Note: *; Rating: *; Distributor Part Number: 490-1543-1-ND; Distributor: Digi-Key
FB2 = Ferrite Bead: Ferrite bead, RF choke; Manufacturer: Murata Electronics North America; Manufacturer Part Number: BLM18HE152SN1D; Digi-Key Part Number: 490-5216-1-ND; Rating: *; Note: *; Value: *; Distributor: Digikey; Distributor Part Number: 490-5216-1-ND
R103 = Res: as R93 on sheet Sensors; Digi-Key Part Number: *; Rating: *; Note: *; Distributor: Digi-Key; Distributor Part Number: YAG2319CT-ND
R104 = Res: Chip Resistor (Surface Mount); Manufacturer: Vishay Dale; Manufacturer Part Number: CRCW06031K50JNEA; Digi-Key Part Number: *; Rating: *; Note: *; Distributor: Digi-Key; Distributor Part Number: 541-1.5KGCT-ND
R105 = Res: as R9 on sheet CapBank; Digi-Key Part Number: *; Rating: *; Note: *; Distributor: Digi-Key; Distributor Part Number: 311-0.0GRCT-ND
R106 = Res: Chip Resistor (Surface Mount); Manufacturer: Yageo; Manufacturer Part Number: RC0603FR-07750KL; Digi-Key Part Number: *; Rating: *; Note: *; Distributor: Digi-Key; Distributor Part Number: 311-750KHRCT-ND
R107 = Res: Chip Resistor (Surface Mount); Manufacturer: Yageo; Manufacturer Part Number: RC0603FR-07240KL; Digi-Key Part Number: *; Rating: *; Note: *; Distributor: Digi-Key; Distributor Part Number: 311-240KHRCT-ND
U21 = SPU0414HR5H: Knowles Analog Top MEMS Microphone; Manufacturer Part Number: SPU0414HR5H-SB; Digi-Key Part Number: 423-1134-1-ND; Distributor: Mouser; Distributor Part Number: 721-SPU0414HR5H-SB; Manufacturer: Knowles; Mouser Part Number: 721-SPU0414HR5H-SB
U22 = OPA333, 2333: Low power opamp; Manufacture: Maxim Integrated; Manufacture Part Number: MAX9914EXK+T; Digi-Key Part Number: MAX9914EXK+TCT-ND; Distributor: Mouser; Distributor Part Number: 700-MAX9914EXKT; Note: *; Rating: *; Value: *; Mouser Part Number: 700-MAX9914EXKT